# EAGLE schematic Rear CAN Backplane (EAGLE 5.12)
PARTNO: 43045-0218
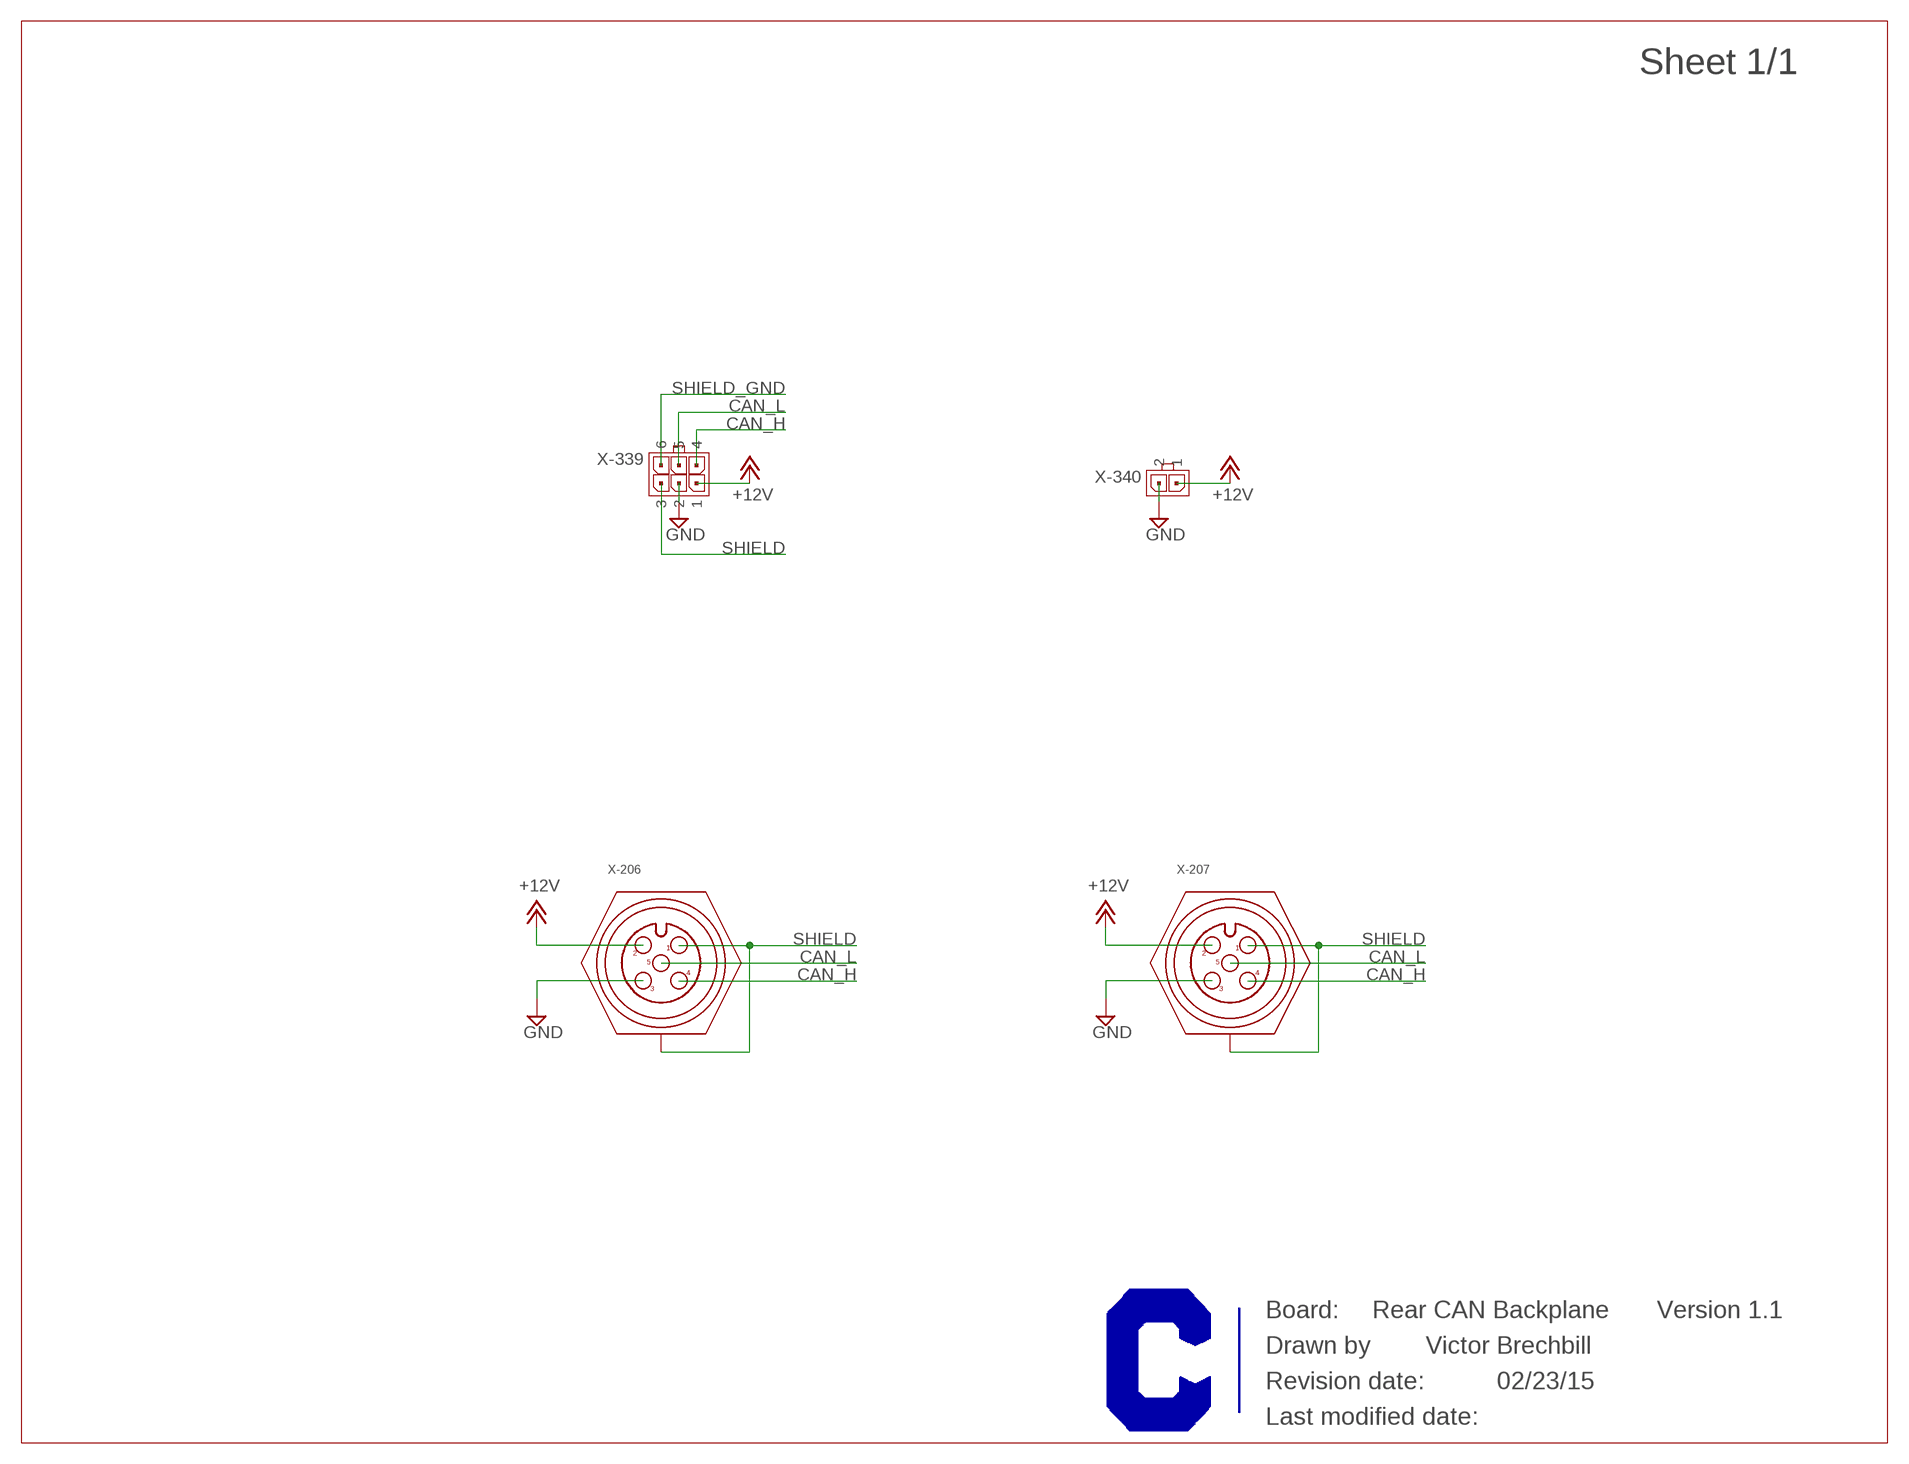
[diagram p0: schematic, sheet 1]

## Parts
U$1  CURRENT-C-LETTER-LANDSCAPE  [BLANK]
X-206  M12-5-VERT-PCB-MALE  [M12-VERT-PCB]
X-207  M12-5-VERT-PCB-MALE  [M12-VERT-PCB]
X-339  MICROFIT-06-DUAL-VERT-SMD-CLIP_RETENTION  [MICROFIT-6-VERT-SMD-CLIP_RETENTION]
X-340  MICROFIT-02-SINGLE-VERT-SMD  [MICROFIT-2-SINGLE-VERT-SMD]

## Nets
+12V: X-206.2 X-207.2 X-339.1 X-340.1
CAN_H: X-206.4 X-207.4 X-339.4
CAN_L: X-206.5 X-207.5 X-339.5
GND: X-206.3 X-207.3 X-339.2 X-339.6 X-340.2
SHIELD: X-206.1 X-206.SHIELD X-207.1 X-207.SHIELD X-339.3

## Notes on the sheet
- SHIELD_GND
- Rear CAN Backplane | Version 1.1
- Victor Brechbill
- 02/23/15

## Library data of the parts
U$1 = Frames:CURRENT-C-LETTER-LANDSCAPE; BOM: EXCLUDE
X-206 X-207 = Conec:M12-5: http://media.digikey.com/pdf/Data%20Sheets/Conec%20PDFs/43-01208-11_Dwg.pdf; PARTNO: 43-01169
X-339 = Molex:MICROFIT-06-DUAL: Molex MicroFit 3.00mm Pitch Header, Surface Mount, Dual Row, 6 Circuits Note, November 2014: These come in three styles: Through-hole, with metal clip retention to PCB (not currently represented) (cheapest) SMD, with solder tab retention (-SMD) (more expensive, commonly stocked) SMD, with metal clip retention (-SMD-CLIP_RETENTION) (most expensive, not often stocked) Please use them in that order! Drawing: http://www.molex.com/pdm_docs/sd/430450609_sd.pdf (right-angle) Information: http://www.molex.com/molex/products/datasheet.jsp?part=active/0430450618_PCB_HEADERS.xml
X-340 = Molex:MICROFIT-02-SINGLE: Molex MicroFit 3.00mm Pitch Header, Surface Mount, Dual Row, 4 Circuits Molex P/N: 43650-0212 (RA) Drawing: http://www.molex.com/pdm_docs/sd/436500212_sd.pdf (RA)